# EAGLE design one_wire_com_board (EAGLE 9.5.0)
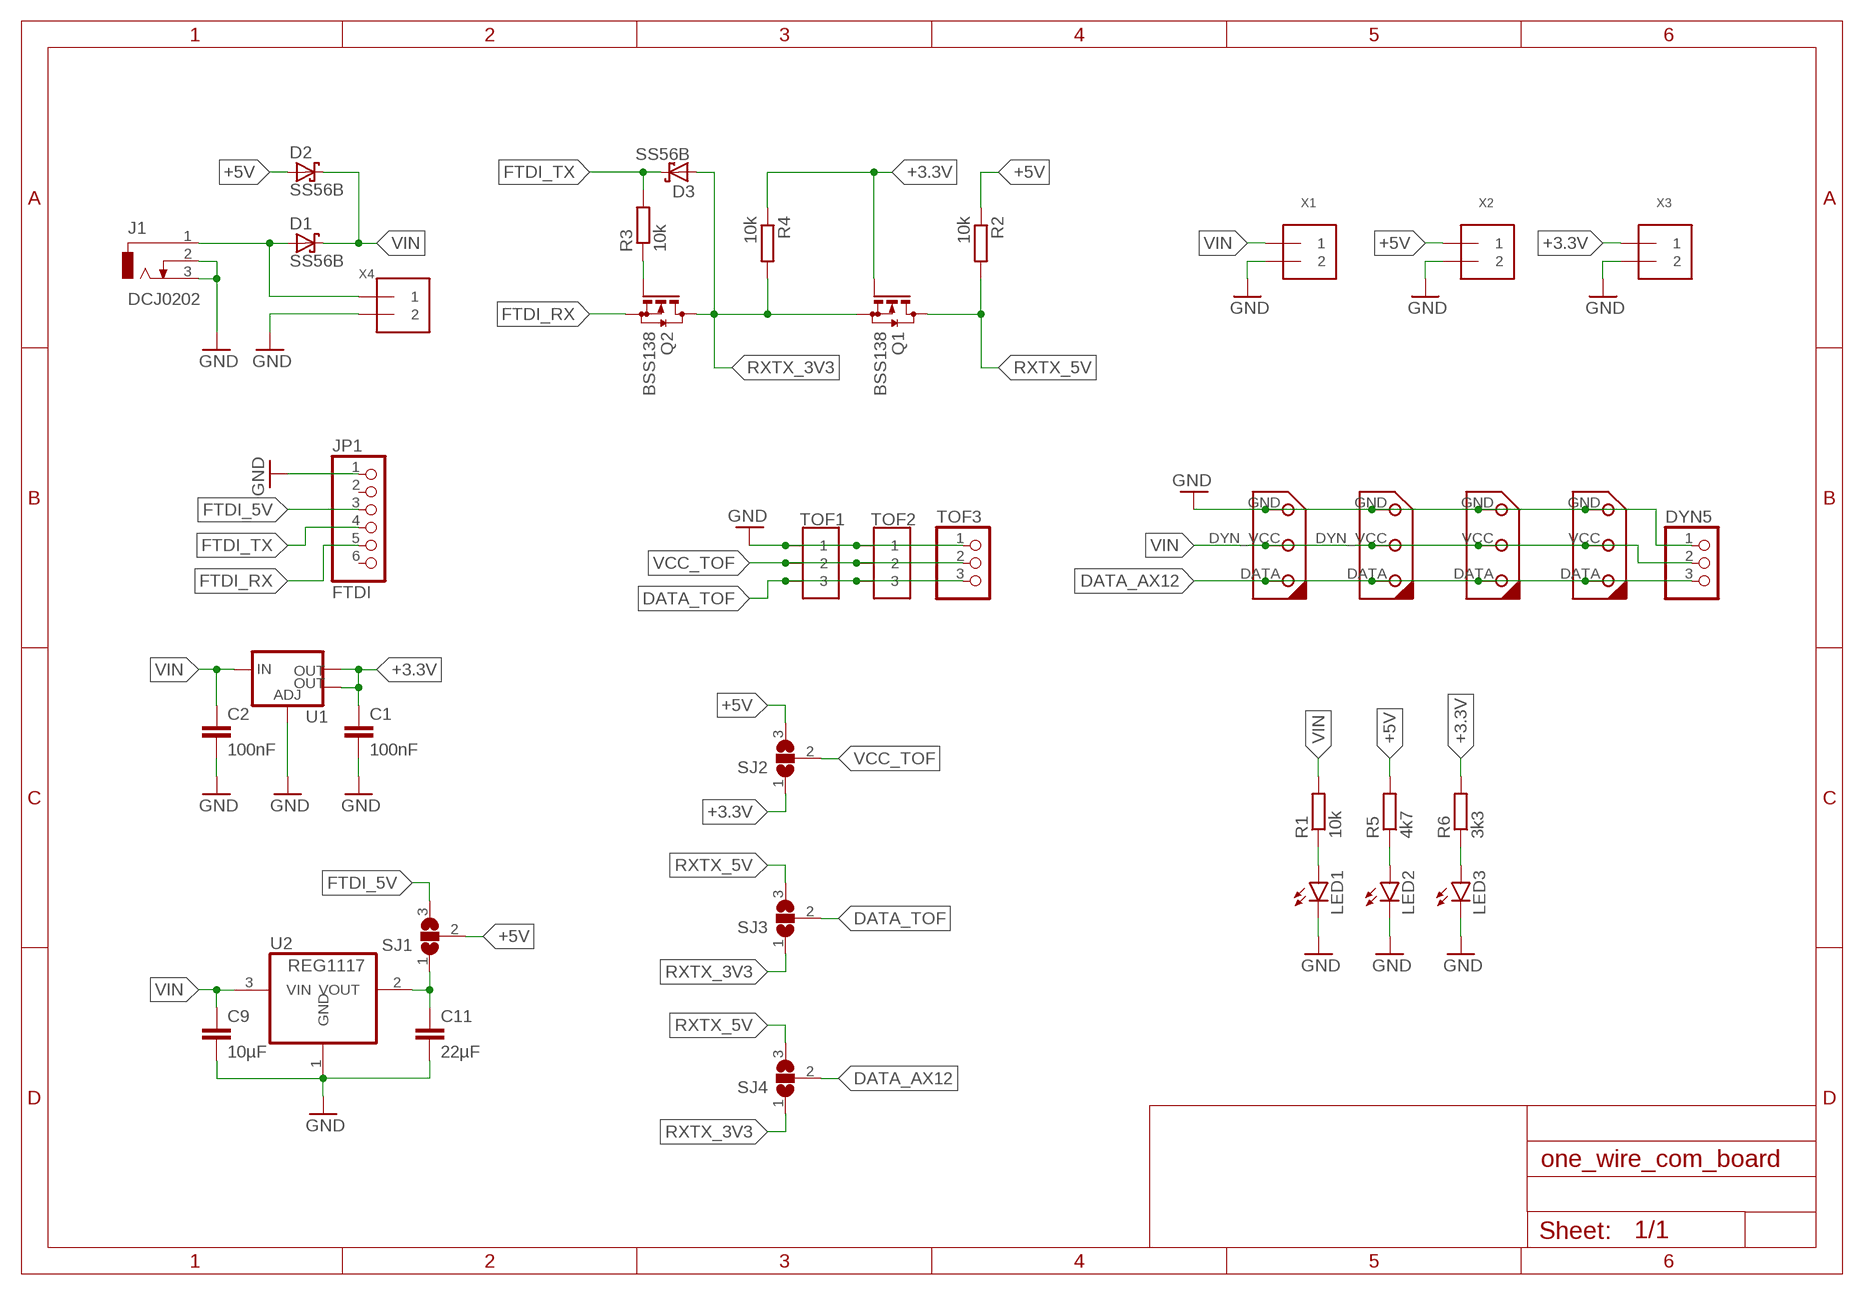
[diagram p0: schematic, sheet 1]

## Parts
C1  100nF  C-EUC0805  [C0805]
C2  100nF  C-EUC0805  [C0805]
C9  10µF  C-EUC0805  [C0805]
C11  22µF  C-EUC0805  [C0805]
D1  SS56B  SCHOTTKY-DIODESMD  [SMB]
D2  SS56B  SCHOTTKY-DIODESMD  [SMB]
D3  SS56B  SCHOTTKY-DIODESMD  [SMB]
DYN1  DYNAMIXEL-1X03AX  [DYNAMIXEL_AX_1X03]
DYN2  DYNAMIXEL-1X03AX  [DYNAMIXEL_AX_1X03]
DYN3  DYNAMIXEL-1X03XL  [DYNAMIXEL_XL_1X03]
DYN4  DYNAMIXEL-1X03XL  [DYNAMIXEL_XL_1X03]
DYN5  PINHD-1X3  [1X03]
J1  DCJ0202  [DCJ0202]
JP1  FTDI  PINHD-1X6/90  [1X06/90]
LED1  LEDSMT1206  [1206]
LED2  LEDSMT1206  [1206]
LED3  LEDSMT1206  [1206]
Q1  BSS138  BSS123  [SOT23]
Q2  BSS138  BSS123  [SOT23]
R1  10k  R-EU_R0805  [R0805]
R2  10k  R-EU_R0805  [R0805]
R3  10k  R-EU_R0805  [R0805]
R4  10k  R-EU_R0805  [R0805]
R5  4k7  R-EU_R0805  [R0805]
R6  3k3  R-EU_R0805  [R0805]
SJ1  SJ2W  [SJ_2]
SJ2  SJ2W  [SJ_2]
SJ3  SJ2W  [SJ_2]
SJ4  SJ2W  [SJ_2]
TOF1  JST-03  [GH-03-V]
TOF2  JST-03  [GH-03-V]
TOF3  PINHD-1X3  [1X03]
U1  V_REG_LM1117SOT223  [SOT223]
U2  REG1117  [SOT223]
X1  TERMBLOCK_1X2  [TERMBLOCK_1X2-3.5MM]
X2  TERMBLOCK_1X2  [TERMBLOCK_1X2-3.5MM]
X3  TERMBLOCK_1X2  [TERMBLOCK_1X2-3.5MM]
X4  TERMBLOCK_1X2  [TERMBLOCK_1X2-3.5MM]

## Nets
+3.3V: C1.1 Q1.1(G) R4.1 R6.2 SJ2.1 U1.2(OUT) U1.4(OUT) X3.1
+5V: D2.A R2.1 R5.2 SJ1.2 SJ2.3 X2.1
DATA_AX12: DYN1.DATA DYN2.DATA DYN3.DATA DYN4.DATA DYN5.3 SJ4.2
DATA_TOF: SJ3.2 TOF1.3 TOF2.3 TOF3.3
FTDI_5V: JP1.3 SJ1.3
FTDI_RX: JP1.5 Q2.2(S)
FTDI_TX: D3.C JP1.4 R3.2
GND: C1.2 C2.2 C9.2 C11.2 DYN1.GND DYN2.GND DYN3.GND DYN4.GND DYN5.1 J1.2 J1.3 JP1.1 LED1.C LED2.C LED3.C TOF1.1 TOF2.1 TOF3.1 U1.1(ADJ) U2.1(GND) X1.2 X2.2 X3.2 X4.2
N$1: D1.A J1.1 X4.1
N$2: LED1.A R1.1
N$3: C11.1 SJ1.1 U2.2(VOUT)
N$4: Q2.1(G) R3.1
N$6: LED2.A R5.1
N$8: LED3.A R6.1
RXTX_3V3: D3.A Q1.2(S) Q2.3(D) R4.2 SJ3.1 SJ4.1
RXTX_5V: Q1.3(D) R2.2 SJ3.3 SJ4.3
VCC_TOF: SJ2.2 TOF1.2 TOF2.2 TOF3.2
VIN: C2.1 C9.1 D1.C D2.C DYN1.DYN_VCC DYN2.DYN_VCC DYN3.VCC(DYN_VCC) DYN4.VCC(DYN_VCC) DYN5.2 R1.2 U1.3(IN) U2.3(VIN) X1.1
Unconnected: JP1.2 JP1.6

## Library data of the parts
C1 C2 = resistor:C-EU: CAPACITOR, European symbol; PARTNO: *
C9 C11 = resistor:C-EU: CAPACITOR, European symbol
D1-D3 = diode:SCHOTTKY-DIODE: Schottky Diode; RS: 917-9221
DYN1 DYN2 = 1NTech_pinhead:DYNAMIXEL-1X03; RS: 687-8124; RS_AX: 687-8124; RS_XL: 688-3283
DYN3 DYN4 = 1NTech_pinhead:DYNAMIXEL-1X03; RS: 688-3283
DYN5 TOF3 = pinhead:PINHD-1X3: PIN HEADER
J1 = con-jack:DCJ0202: DC POWER JACK Source: DCJ0202.pdf; OC_FARNELL: unknown; OC_NEWARK: unknown
JP1 = pinhead:PINHD-1X6: PIN HEADER; REF_MANF: TTL-234X-3V3
LED1-LED3 = led:LED: LED OSRAM: - CHIPLED LG R971, LG N971, LY N971, LG Q971, LY Q971, LO R971, LY R971 LH N974, LH R974 LS Q976, LO Q976, LY Q976 LO Q996 - Hyper CHIPLED LW Q18S LB Q993, LB Q99A, LB R99A - SideLED LS A670, LO A670, LY A670, LG A670, LP A670 LB A673, LV A673, LT A673, LW A673 LH A674 LY A675 LS A676, LA A676, LO A676, LY A676, LW A676 LS A679, LY A679, LG A679 - Hyper Micro SIDELED® LS Y876, LA Y876, LO Y876, LY Y876 LT Y87S - SmartLED LW L88C, LW L88S LB L89C, LB L89S, LG L890 LS L89K, LO L89K, LY L89K LS L896, LA L896, LO L896, LY L896 - TOPLED LS T670, LO T670, LY T670, LG T670, LP T670 LSG T670, LSP T670, LSY T670, LOP T670, LYG T670 LG T671, LOG T671, LSG T671 LB T673, LV T673, LT T673, LW T673 LH T674 LS T676, LA T676, LO T676, LY T676, LB T676, LH T676, LSB T676, LW T676 LB T67C, LV T67C, LT T67C, LS T67K, LO T67K, LY T67K, LW E67C LS E67B, LA E67B, LO E67B, LY E67B, LB E67C, LV E67C, LT E67C LW T67C LS T679, LY T679, LG T679 LS T770, LO T770, LY T770, LG T770, LP T770 LB T773, LV T773, LT T773, LW T773 LH T774 LS E675, LA E675, LY E675, LS T675 LS T776, LA T776, LO T776, LY T776, LB T776 LHGB T686 LT T68C, LB T68C - Hyper Mini TOPLED® LB M676 - Mini TOPLED Santana® LG M470 LS M47K, LO M47K, LY M47K Source: http://www.osram.convergy.de LUXEON: - LUMILED® LXK2-PW12-R00, LXK2-PW12-S00, LXK2-PW14-U00, LXK2-PW14-V00 LXK2-PM12-R00, LXK2-PM12-S00, LXK2-PM14-U00 LXK2-PE12-Q00, LXK2-PE12-R00, LXK2-PE12-S00, LXK2-PE14-T00, LXK2-PE14-U00 LXK2-PB12-K00, LXK2-PB12-L00, LXK2-PB12-M00, LXK2-PB14-N00, LXK2-PB14-P00, LXK2-PB14-Q00 LXK2-PR12-L00, LXK2-PR12-M00, LXK2-PR14-Q00, LXK2-PR14-R00 LXK2-PD12-Q00, LXK2-PD12-R00, LXK2-PD12-S00 LXK2-PH12-R00, LXK2-PH12-S00 LXK2-PL12-P00, LXK2-PL12-Q00, LXK2-PL12-R00 Source: www.luxeon.com KINGBRIGHT: KA-3528ASYC Source: www.kingbright.com; RS: 726-9215
Q1 Q2 = transistor-small-signal:BSS123: N-CHANNEL MOS FET; RS: 669-7559
R1-R6 = resistor:R-EU_: RESISTOR, European symbol
SJ1-SJ4 = jumper:SJ2W: SMD solder JUMPER
TOF1 TOF2 = con-jst:JST-03; RS: 752-1765; RS_F: 752-1737
U1 = SparkFun-PowerIC:V_REG_LM1117: Voltage Regulator LM1117 Standard adjustable voltage regulator but in SMD form. Spark Fun Electronics SKU : COM-00595; PARTNO: *; PROD_ID: VREG-08170; REF-RS: 828-7609
U2 = burr-brown:REG1117: 800mA and 1A Low Dropout (LDO) Positive Regulator 1.8V, 2.5V, 2.85V, 3.3V, 5V, and Adj; MPN: REG1117; OC_FARNELL: 1097566; OC_NEWARK: 14P6981; RS: 885-5432
X1-X4 = microbuilder:TERMBLOCK_1X2: 3.5mm Terminal block http://www.ladyada.net/library/pcb/eaglelibrary.html

## Net classes
2 2A: width 0.8 mm, drill 0.4 mm
3 1A: width 0.3 mm, drill 0.35 mm

## Board
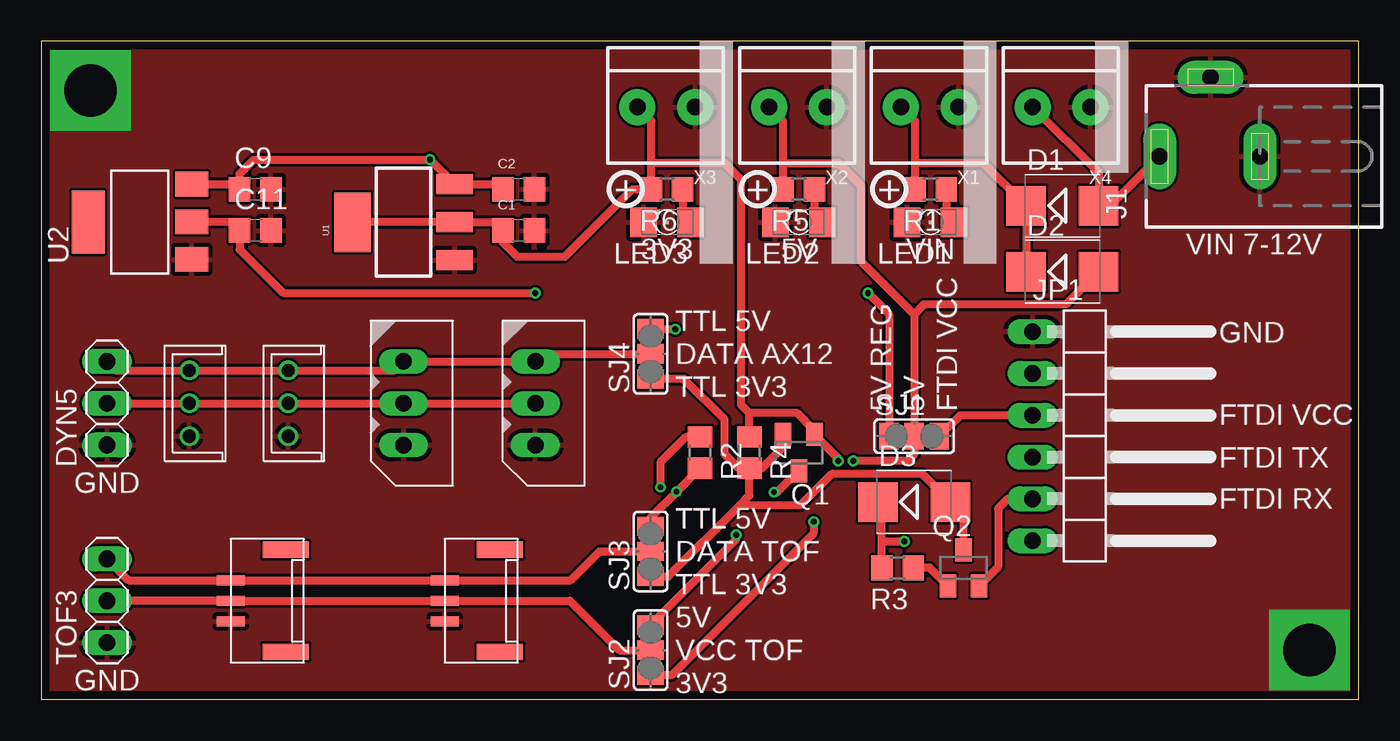
[diagram p1: board, top side]
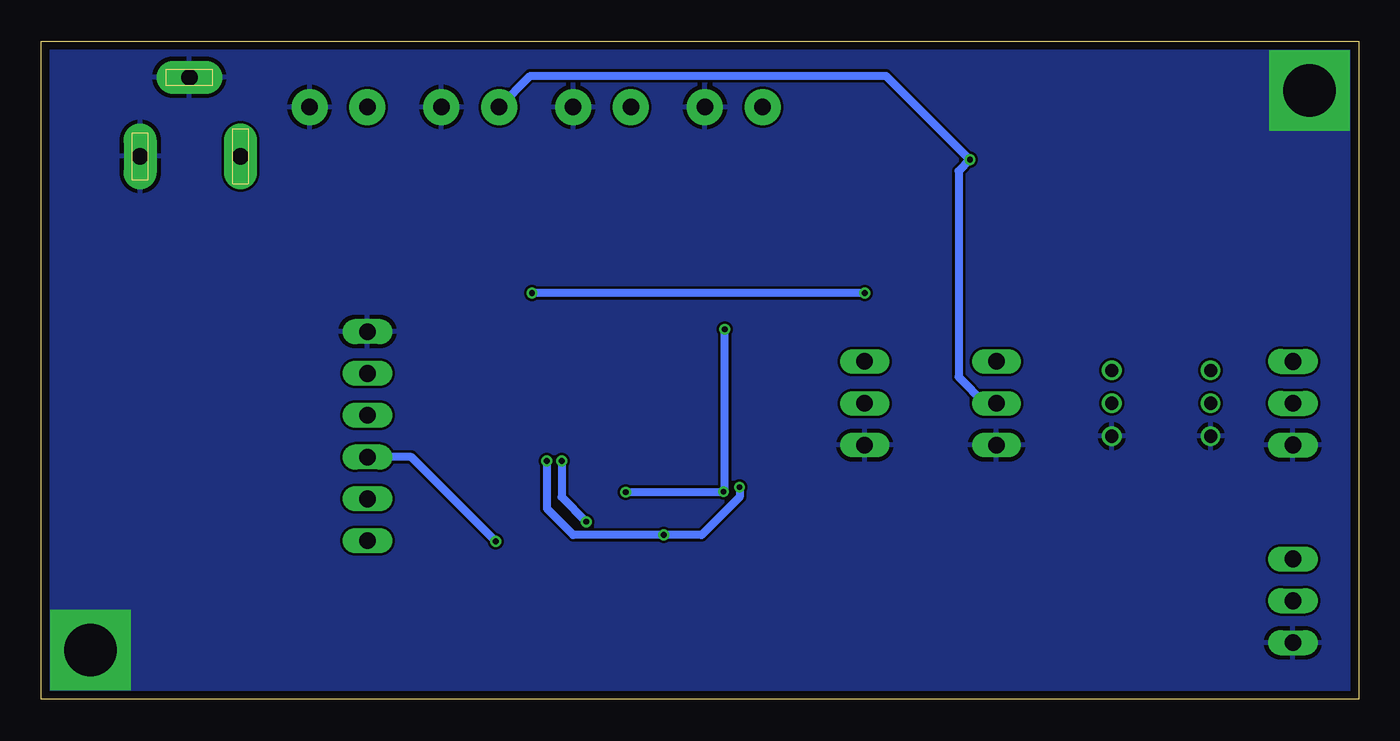
[diagram p2: board, bottom side, seen from below]

Size 80 x 40 mm. Coordinates in mm from the lower left corner, seen from the top.
Outline: 0,0 80,0 80,40 0,40 0,0
Copper layers (1*16): Top 0.035mm / dielectric 1.6mm / Bottom 0.035mm
Design rules "Elecrow_2-layer_PCB_eagle_rule *": minimum track width 6mil, minimum drill 12mil, track to track 6mil, track to pad 6mil, pad to pad 6mil, via to via 8mil, smd to smd 0mil, copper to edge 20mil, drill to drill 10mil, minimum pad ring 6mil, minimum via ring 6mil, stop-mask expansion 0mil, vias tented up to drill 100mil, thermal gap 10mil

### Footprints (pad centres in the part's own frame; a part is rotated, then mirrored left to right if it is on the bottom)
C0805 = smd 1.3 x 1.5: 1 -0.95,0; 2 0.95,0
SMB = smd 2.4 x 2.4: A 2.2,0; C -2.2,0
DYNAMIXEL_AX_1X03 = drill 1 long: DATA 2.54,0; DYN_VCC 0,0; GND -2.54,0
DYNAMIXEL_XL_1X03 = drill 0.8: DATA 2,0; GND -2,0; VCC 0,0
1X03 = drill 1.016 long: 1 -2.54,0; 2 0,0; 3 2.54,0
DCJ0202 = drill 1 pad 2 long: 1 0,3.1; 2 4.8,0; 3 0,-3
1X06/90 = drill 1.016 long: 1 -6.35,-3.81; 2 -3.81,-3.81; 3 -1.27,-3.81; 4 1.27,-3.81; 5 3.81,-3.81; 6 6.35,-3.81
1206 = smd 1.6 x 1.803: A -1.422,0; C 1.422,0
SOT23 = smd 1 x 1.4: 1 -0.95,-1.1; 2 0.95,-1.1; 3 0,1.1
R0805 = smd 1.3 x 1.5: 1 -0.95,0; 2 0.95,0
SJ_2 = smd 1.168 x 1.6: 1 -1.524,0; 2 0,0; 3 1.524,0
GH-03-V = smd 0.6 x 1.7: 1 -1.25,2.5; 2 0,2.5; 3 1.25,2.5 | smd 1 x 2.8: CASE0 3.1,-0.85; CASE1 -3.1,-0.85
SOT223 = smd 1.219 x 2.235: 1 -2.311,-3.099; 2 0,-3.099; 3 2.311,-3.099 | smd 3.6 x 2.2: 4 0,3.099
SOT223' = smd 1.499 x 2.007: 1 -2.261,-3.15; 2 0.025,-3.15; 3 2.311,-3.15 | smd 3.81 x 2.007: 4 0,3.15
TERMBLOCK_1X2-3.5MM = drill 1 pad 2.184: 1 1.8,0; 2 -1.7,0

### Placement (x,y rotation side)
C1  29,28.5 0 top
C2  29,31 0 top
C9  13,31 0 top
C11  13,28.5 0 top
D1  62,30 0 top
D2  62,26 0 top
D3  53,12 0 top
DYN1  30,18 90 top
DYN2  22,18 90 top
DYN3  9,18 90 top
DYN4  15,18 90 top
DYN5  4,18 90 top
J1  71,33 90 top
JP1  64,16 270 top
LED1  54,29 180 top
LED2  46,29 180 top
LED3  38,29 180 top
Q1  46,15 180 top
Q2  56,8 0 top
R1  54,31 180 top
R2  40,15 270 top
R3  52,8 180 top
R4  43,15 270 top
R5  46,31 180 top
R6  38,31 180 top
SJ1  53,16 0 top
SJ2  37,3 90 top
SJ3  37,9 90 top
SJ4  37,21 90 top
TOF1  27,6 90 top
TOF2  14,6 90 top
TOF3  4,6 90 top
U1  22,29 90 top
U2  REG1117  [SOT223']  6,29 90 top
X1  54,36 180 top
X2  46,36 180 top
X3  38,36 180 top
X4  62,36 180 top

### Tracks (layer width: path | path; a pad name or v marks a point on that pad's centre or on a via)
+3.3V  (via drill 0.35)
  Top 0.5: 37.05,32.6 R6.2 35.9,31 31.8,26.9 28.9,26.9 28.05,27.75 C1.1 27.55,29 U1.2 U1.4 | 37.05,32.6 37.05,35.15 X3.1 | 43,17.4 45.9,17.4 46.95,16.35 Q1.1 48.4,14.65 v48.4,14.5 | 43,17.4 42.5,17.9 42.5,31.6 41.5,32.6 37.05,32.6 | R4.1 43,17.4 | v46.9,10.8 46.9,10.1 38.28,1.48 SJ2.1
  Bottom 0.5: v48.4,14.5 48.4,12.3 v46.9,10.8
+5V  (via drill 0.35)
  Top 0.5: R5.2 45.05,32.6 | 45.05,32.6 45.05,35.15 X2.1 | D2.A 62.2,24 53.6,24 53,23.4 | 53,23.4 SJ1.2 53,14.9 52.6,14.5 v49.3,14.5 | 45.05,32.6 48.4,32.6 49.8,31.2 49.8,26.6 53,23.4 | R2.1 39.15,15.95 37.6,14.4 v37.6,12.9 | SJ2.3 42.2,9.72 v42.2,10
  Bottom 0.5: v37.6,12.9 37.6,12.3 39.9,10 v42.2,10 47.7,10 49.3,11.6 v49.3,14.5
DATA_AX12
  Top 0.5: DYN5.3 4.54,20 DYN3.DATA DYN4.DATA 21.46,20 DYN2.DATA DYN1.DATA 30.46,21 SJ4.2
DATA_TOF
  Top 0.5: TOF3.3 5.29,7.25 TOF2.3 TOF1.3 32.15,7.25 33.9,9 SJ3.2
FTDI_5V
  Top 0.5: JP1.3 55.79,17.27 SJ1.3
FTDI_RX
  Top 0.5: JP1.5 58.69,12.19 58.1,11.6 58.1,8.05 Q2.2
FTDI_TX  (via drill 0.35)
  Top 0.5: R3.2 51.05,9.6 | 51.05,9.6 51.05,11.75 D3.C | 51.05,9.6 v52.4,9.6
  Bottom 0.5: v52.4,9.6 57.53,14.73 JP1.4
GND  (via drill 3.2 pad 4.9)
  other vias: 3,37 77,3
  pour Top: 0,40 80,40 80,0 0,0
  pour Bottom: 0,40 80,40 80,0 0,0
N$1
  Top 0.5: X4.1 64.2,32 D1.A 64.9,30 J1.1
N$2
  Top 0.5: R1.1 54.95,29.47 LED1.A
N$3  (via drill 0.35)
  Top 0.5: U2.2 11.53,29.02 C11.1 12.05,27.35 14.7,24.7 v30,24.7 | v50.2,24.7 51.48,23.42 SJ1.1
  Bottom 0.5: v30,24.7 v50.2,24.7
N$4
  Top 0.5: Q2.1 53.95,8 R3.1
N$6
  Top 0.5: R5.1 46.95,29.47 LED2.A
N$8
  Top 0.5: R6.1 38.95,29.47 LED3.A
RXTX_3V3
  Top 0.5: Q2.3 56,11.2 D3.A 53.5,13.7 48,13.7 46.1,11.8 42.4,11.8 | SJ3.1 38.08,7.48 42.4,11.8 | R4.2 43,12.4 42.4,11.8 | R4.2 43.75,14.05 45.05,15.35 Q1.2 | R4.2 42.35,14.05 41.5,14.9 41.5,17 39.02,19.48 SJ4.1
RXTX_5V  (via drill 0.35)
  Top 0.5: SJ3.3 37,11.05 v38.58,12.62 R2.2 | Q1.3 44.7,12.6 v44.5,12.6 | v38.5,22.5 38.48,22.52 SJ4.3
  Bottom 0.5: v44.5,12.6 38.6,12.6 v38.58,12.62 38.5,12.7 v38.5,22.5
VCC_TOF
  Top 0.5: TOF3.2 TOF2.2 TOF1.2 32.1,6 35.1,3 SJ2.2
VIN  (via drill 0.35)
  Top 0.5: DYN5.2 DYN3.VCC DYN4.VCC DYN2.DYN_VCC DYN1.DYN_VCC | U2.3 11.74,31.31 C9.1 12.05,31.95 12.9,32.8 v23.61,32.8 U1.3 27.74,31.31 C2.1 | X1.1 53.05,35.15 53.05,32.6 | 53.05,32.6 R1.2 | 53.05,32.6 57.2,32.6 D1.C D2.C
  Bottom 0.5: X1.1 50.3,37.9 28.71,37.9 v23.61,32.8 24.3,32.11 24.3,19.6 22.7,18 DYN2.DYN_VCC

### Text on the board
tPlace: + | + | + | 3V3 | 5V | VIN | VIN 7-12V | TTL 5V | GND | DATA AX12 | TTL 3V3 | 5V REG | 5V | FTDI VCC | FTDI VCC | FTDI TX | GND | FTDI RX | TTL 5V | DATA TOF | TTL 3V3 | 5V | VCC TOF | GND | 3V3